# EAGLE board schematic (EAGLE 9.5.0)
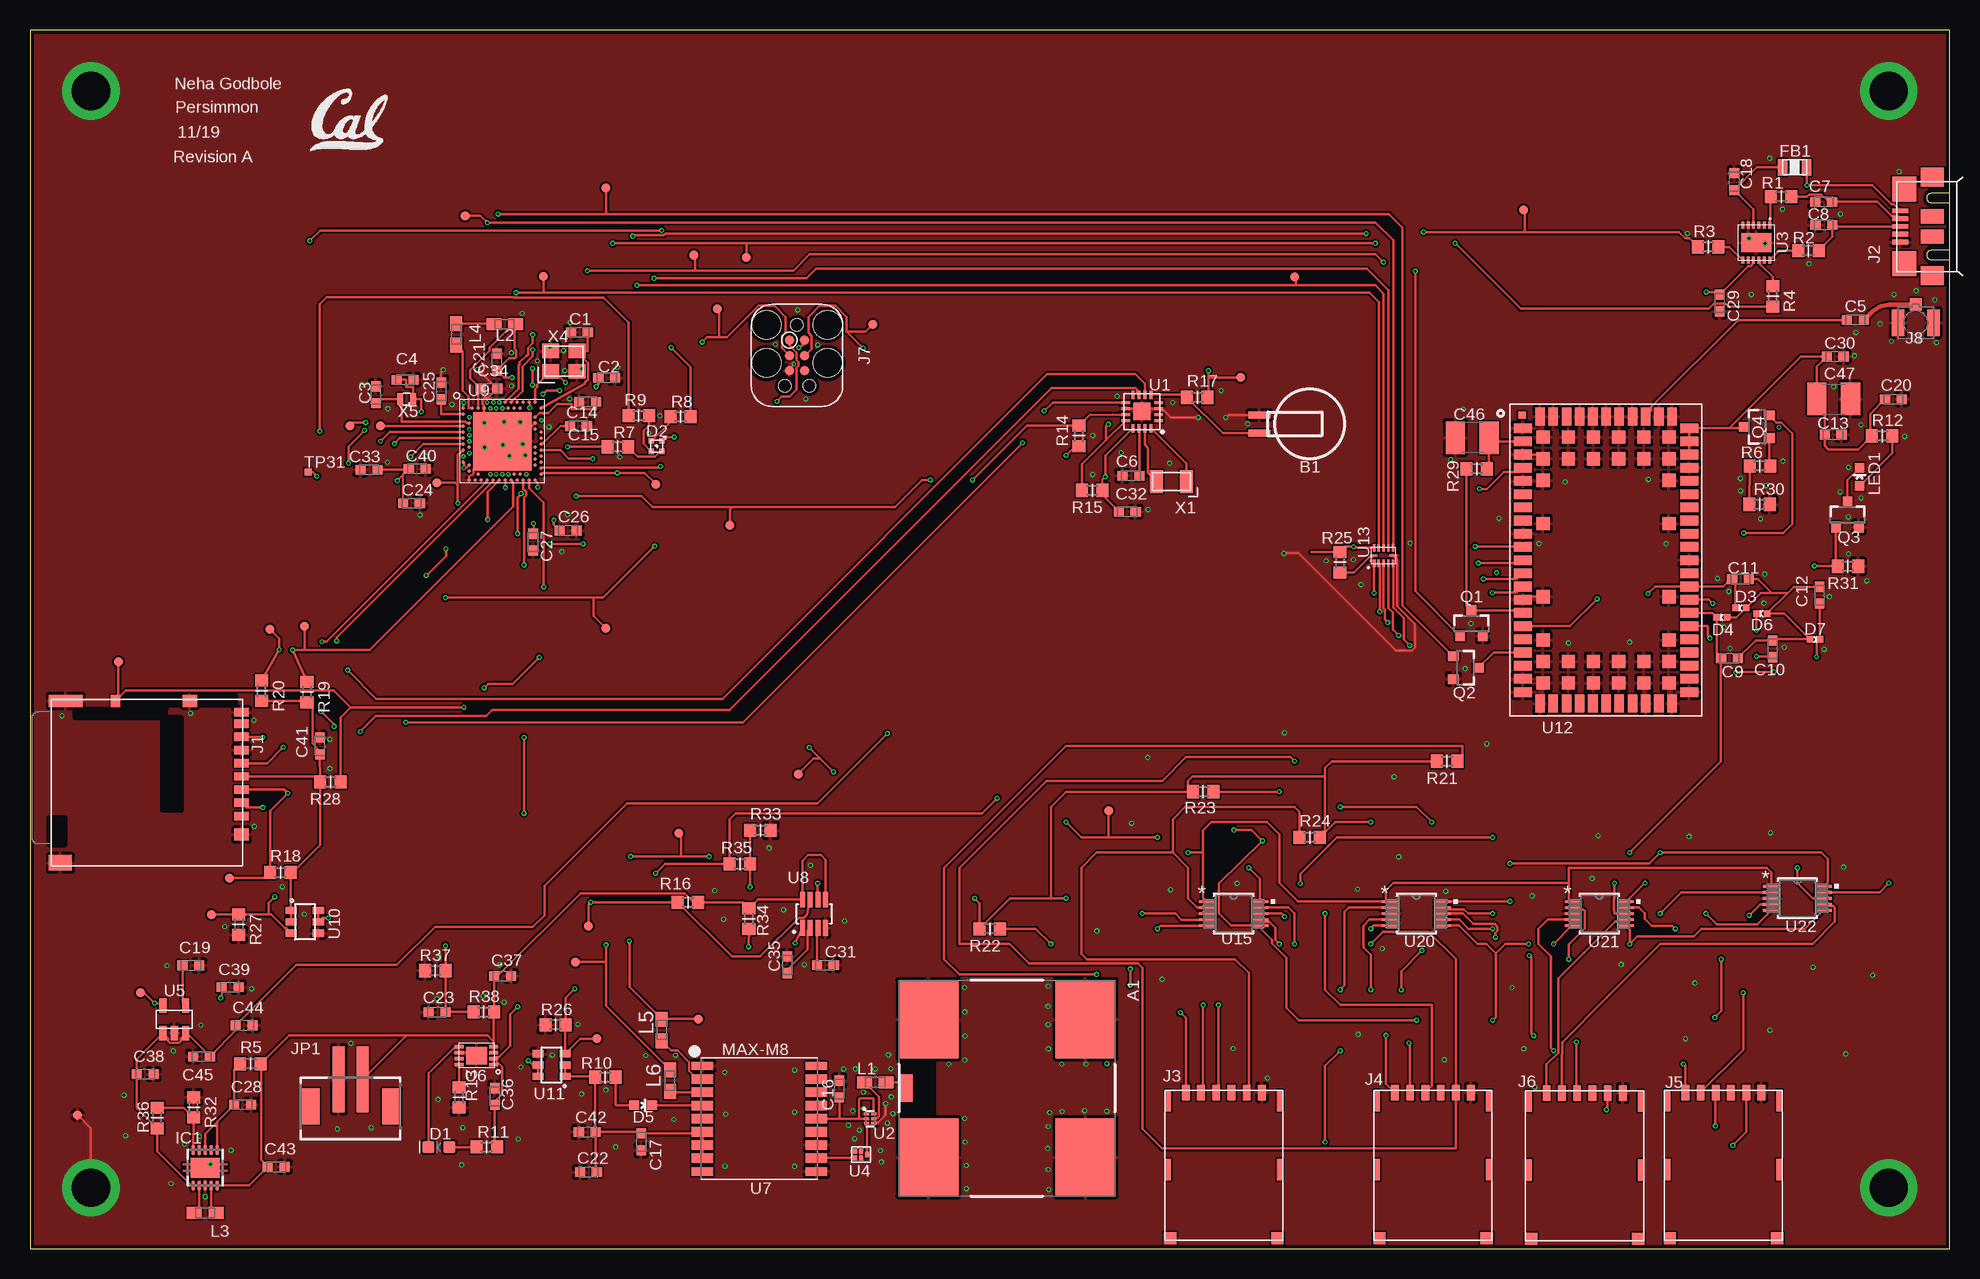
[diagram p8: board, top side]
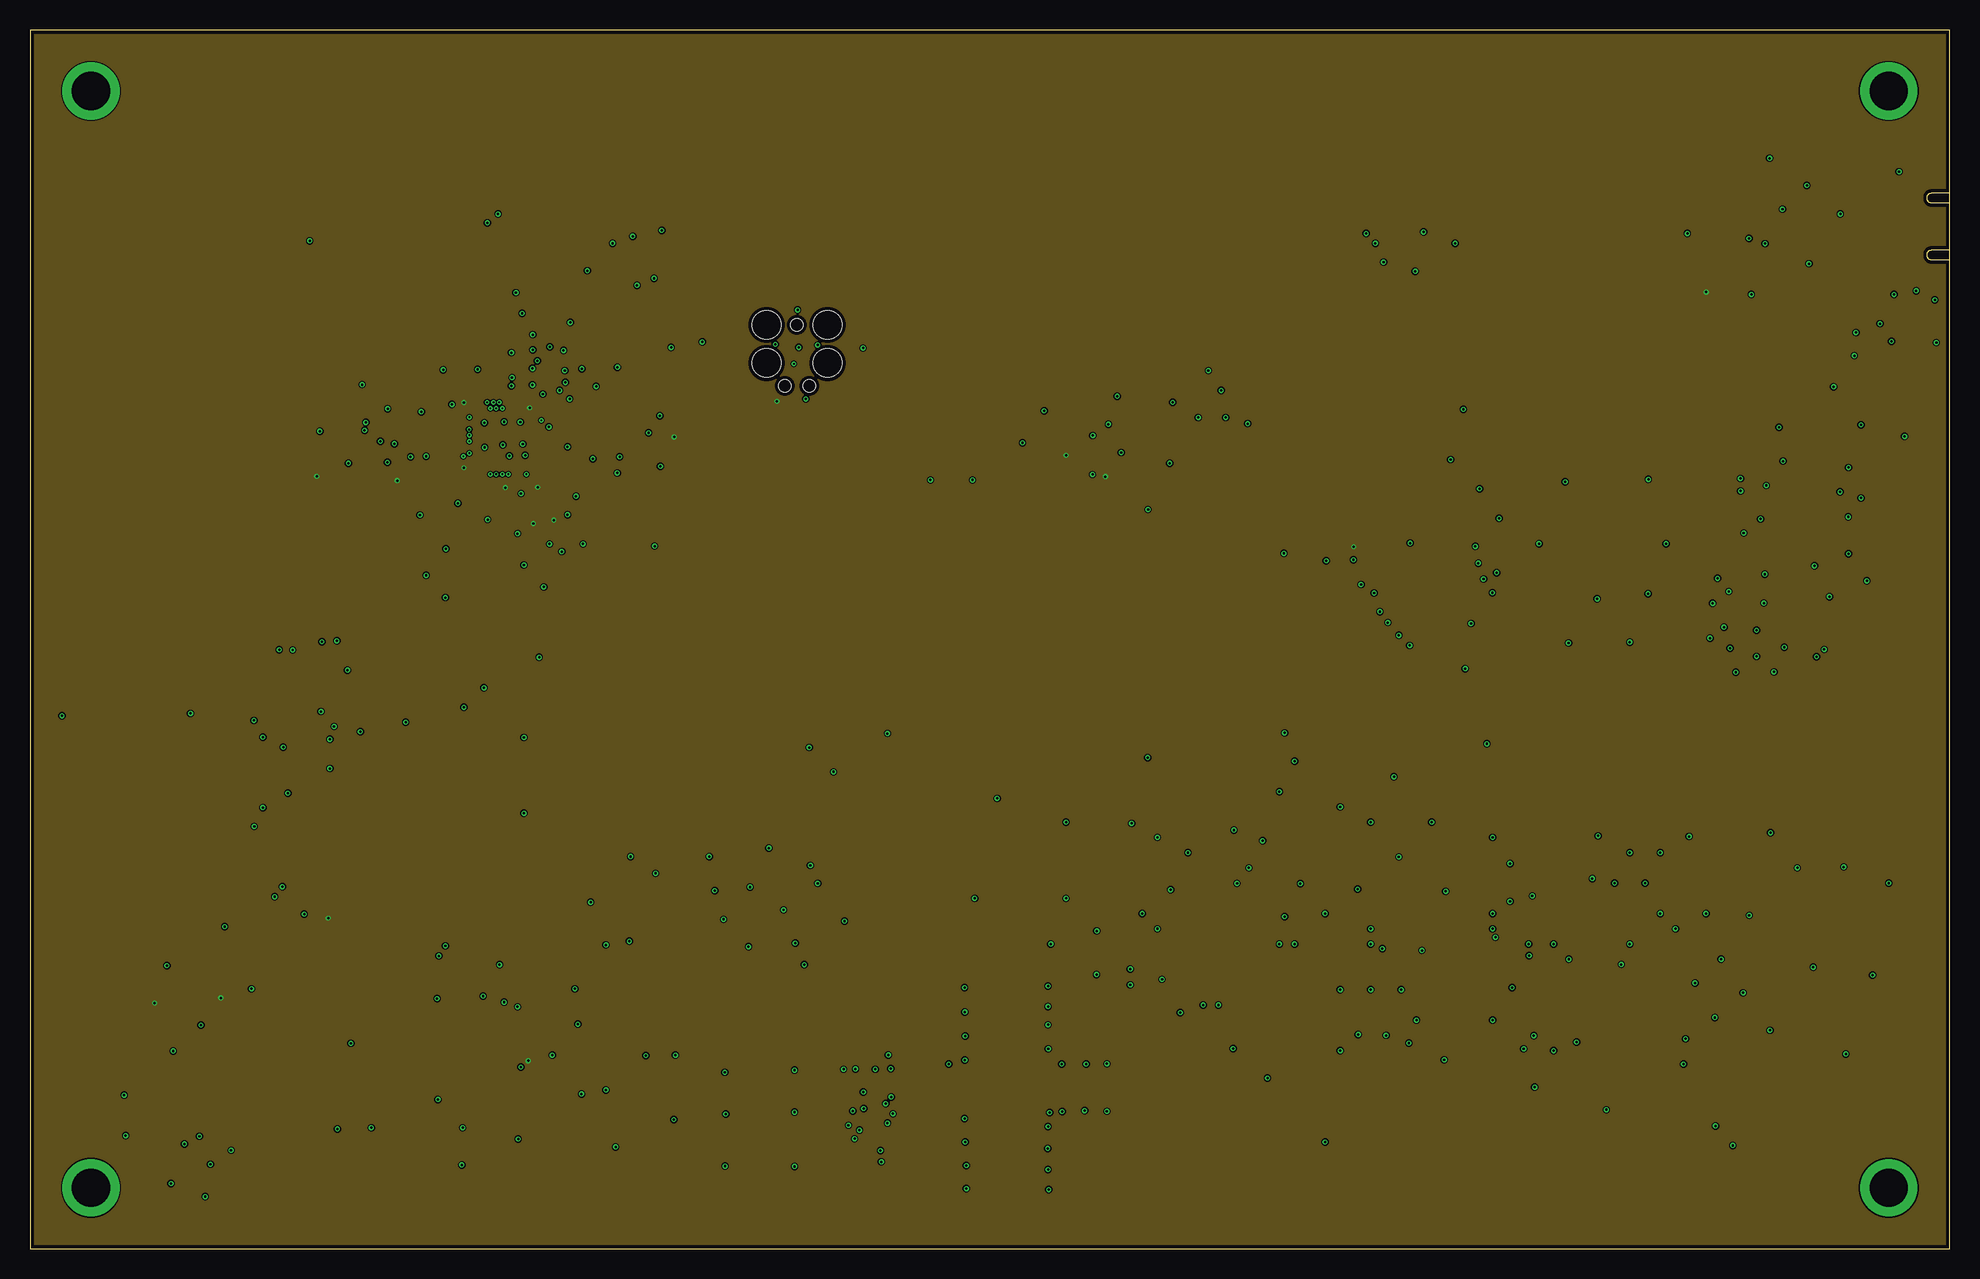
[diagram p9: board, inner layer Route15]
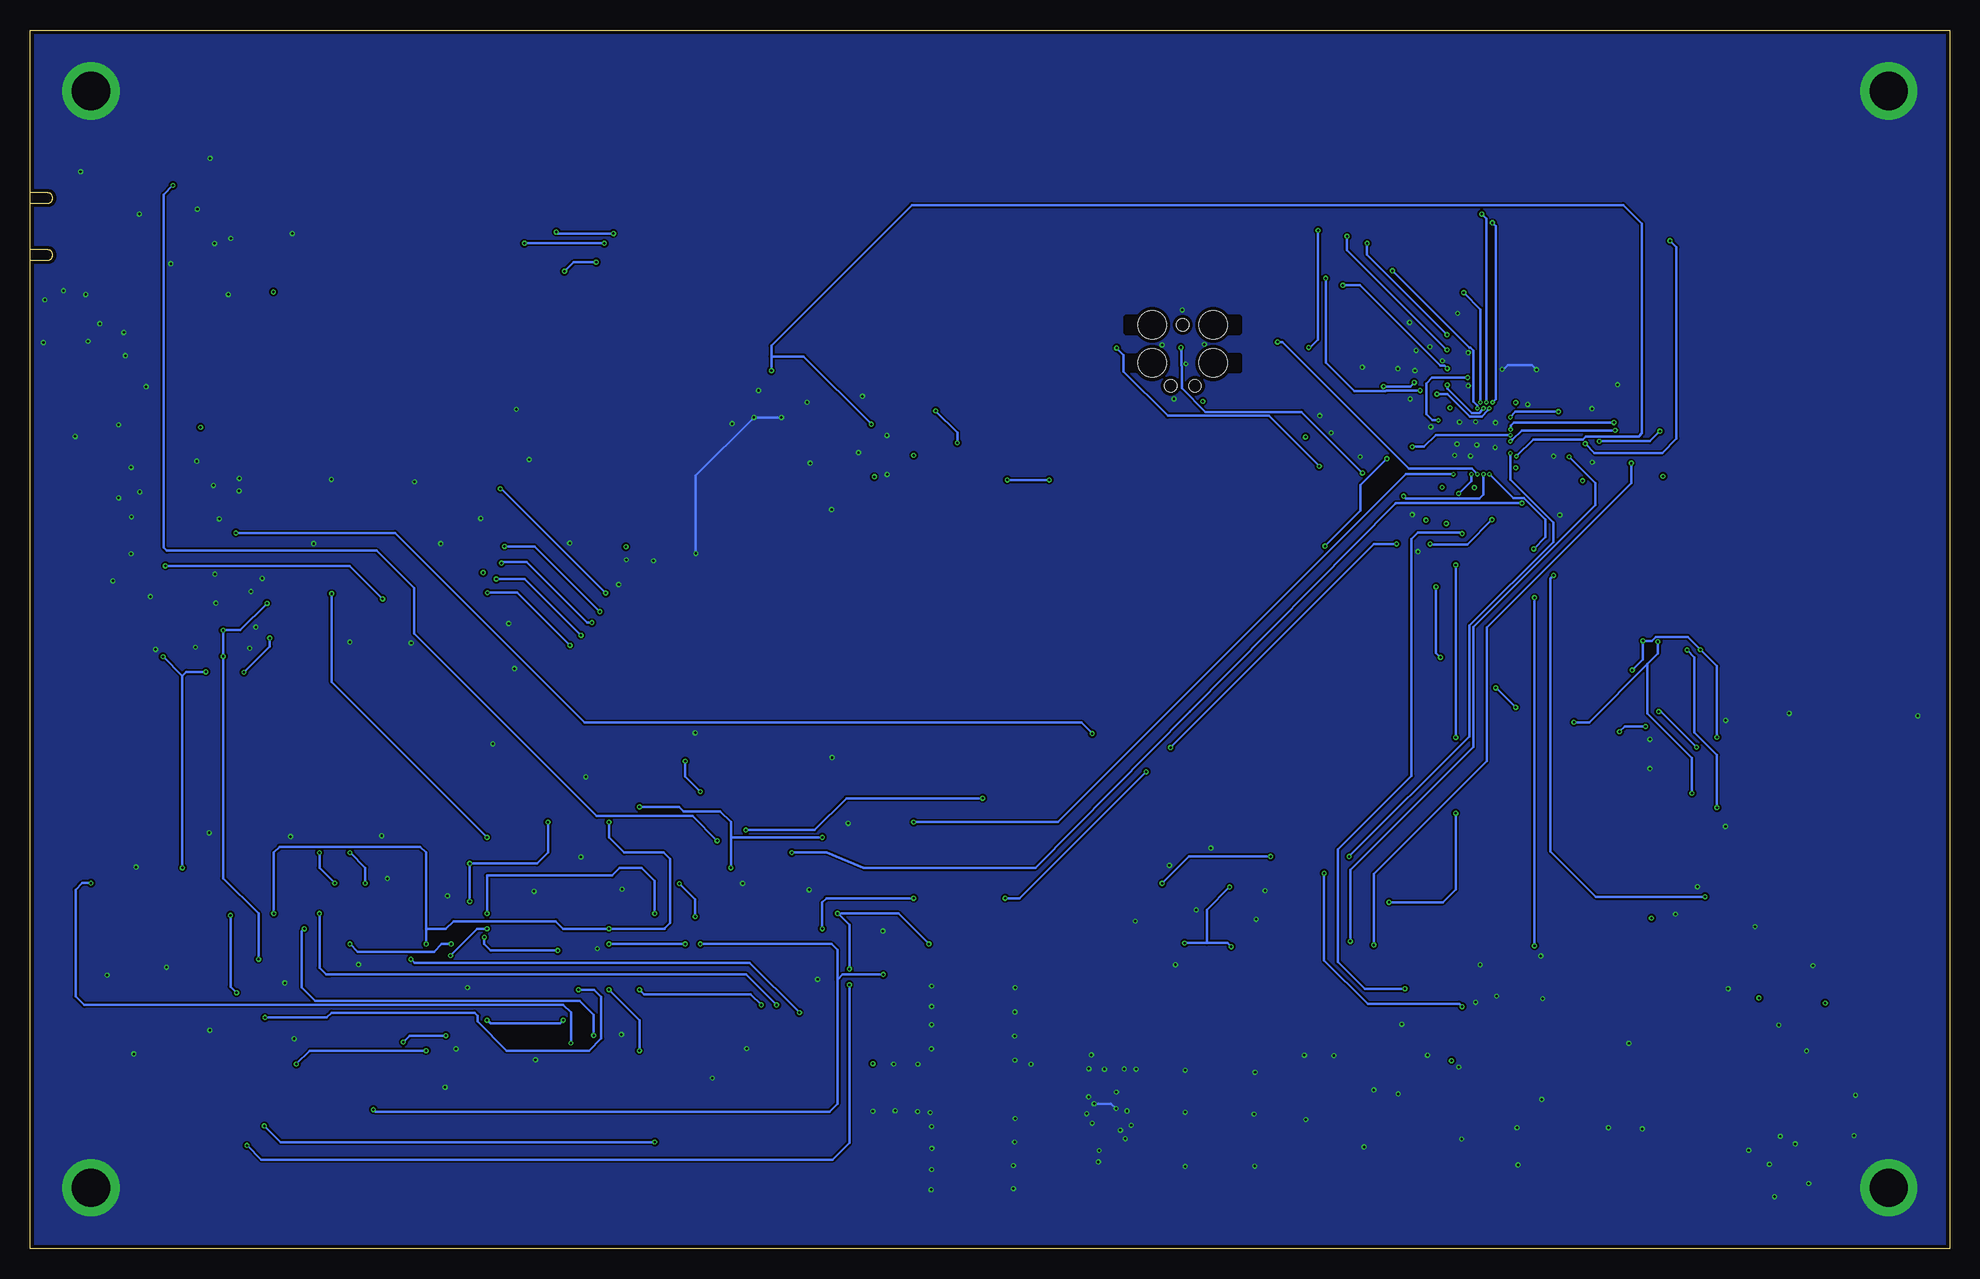
[diagram p10: board, bottom side, seen from below]

Size 160.02 x 101.6 mm. Coordinates in mm from the lower left corner, seen from the top.
Outline: 0,0 160.02,0 160.02,101.6 0,101.6 0,0
Copper layers (1*2+15*16): Top 0.035mm / dielectric 1.5mm / Route2 0.035mm / dielectric 0.15mm / Route15 0.035mm / dielectric 0.2mm / Bottom 0.035mm
Design rules "default *": minimum track width 4mil, minimum drill 6mil, track to track 4mil, track to pad 4mil, pad to pad 4mil, via to via 4mil, smd to smd 4mil, copper to edge 12mil, drill to drill 12mil, minimum pad ring 8mil, minimum via ring 4mil, stop-mask expansion 3mil, vias tented up to drill 50mil, thermal gap 10mil

## Footprints (pad centres in the part's own frame; a part is rotated, then mirrored left to right if it is on the bottom)
ANT1818B00BT1516S = smd 2.3 x 1.2: 0 0,-8.45 | smd 6.5 x 5: 1 -5.75,-6.55; 2 5.75,-6.55; 3 5.75,6.55; 4 -5.75,6.55
MS518SE-FL35E = smd 1.8 x 0.6: + 4.2,0.75; - 4.2,-0.75
RESC0603_L = smd 0.85 x 0.8: 1 -0.7,0; 2 0.7,0
C1210 = smd 1.6 x 2.7: 1 -1.4,0; 2 1.4,0
LED-0603 = smd 1 x 1: A -0.877,0; C 0.877,0
1MM_SQ_4PAD = smd 0.457 x 0.457: 1 0.432,0.432; 2 0.432,-0.432; 3 -0.432,-0.432; 4 -0.432,0.432
0402_DIODE = smd 0.536 x 0.546: ANODE -0.433,0; CATHODE 0.433,0
LED-0603' = smd 0.8 x 0.8: A 0,-0.75; C 0,0.75
0805_CAP = smd 0.8 x 1.4: P$1 1,0; P$2 -1,0
DRC-S-PVSON-N10 = smd 0.28 x 0.85: 1 -1,-1.475; 2 -0.5,-1.475; 3 0,-1.475; 4 0.5,-1.475; 5 1,-1.475; 6 1,1.475; 7 0.5,1.475; 8 0,1.475; 9 -0.5,1.475; 10 -1,1.475 | smd 2.4 x 1.65: TH 0,0
DM3AT-SF-PEJM5 = smd 0.7 x 1.2: 1 3.2,-0.1; 2 2.1,-0.1; 3 1,-0.1; 4 -0.1,-0.1; 5 -1.2,-0.1; 6 -2.3,-0.1; 7 -3.4,-0.1; 8 -4.5,-0.1; B -5.45,-0.1 | smd 1 x 0.8: A -6.4,-10.6 | smd 1 x 1.2: MOUNT0 4.75,-0.1; MOUNT1 -6.4,-4.4 | smd 1 x 2.8: MOUNT2 -6.4,-14.75 | smd 1.3 x 1.9: MOUNT3 7.1,-15.2
USB_MICRO_B-HIROSE-ZX62R-B-5P = smd 0.4 x 1.35: 1 1.3,4.125; 2 0.65,4.125; 3 0,4.125; 4 -0.65,4.125; 5 -1.3,4.125 | smd 2.1 x 2: P$1 3.1,3.8; P$2 -3.1,3.8 | smd 1.6 x 1.9: P$3 -4.1,1.45; P$6 4.1,1.45 | smd 1.2 x 1.9: P$4 -0.85,1.45; P$5 0.85,1.45
WURTH_NANO_SIM = smd 0.65 x 1.3: C1 1.905,6.07; C2 -0.635,6.07; C3 -1.905,6.07; C5 3.175,6.07; C6 0.635,6.07; C7 -3.175,6.07 | smd 1.03 x 1: P$8 -4.465,-6.07; P$9 4.465,-6.07 | smd 0.48 x 1.8: P$10 -4.66,-0.35; P$11 4.66,-0.35; P$12 -4.66,5.4; P$13 4.66,5.4
TC2030-IDC = smd 0.787 x 0.787: 1 -1.27,-0.635; 2 -1.27,0.635; 3 0,-0.635; 4 0,0.635; 5 1.27,-0.635; 6 1.27,0.635 | hole 2.375: -2.54,2.54; 0.635,2.54; 0.635,-2.54; -2.54,-2.54 | hole 1.016: -2.54,0; 2.54,1.016; 2.54,-1.016
U.FL_SMT = smd 1.05 x 2.2: GND1 -1.475,0; GND2 1.475,0 | smd 1 x 1.05: SIG 0,-1.525
JST-2-SMD-VERT = smd 1 x 5.5: GND 1,-2; VCC -1,-2 | smd 1.6 x 3: P$1 -3.4,0.27; P$2 3.4,0.27
RESC0603_M = smd 1.25 x 1: 1 -0.9,0; 2 0.9,0
SOT23-3 = smd 0.8 x 0.9: 1 -0.95,-1; 2 0.95,-1; 3 0,1.1
R0603 = smd 1 x 1.1: 1 -0.85,0; 2 0.85,0
PAD.03X.03 = smd 0.762 x 0.762: P$1 0,0
TP06SQ = smd 0.6 x 0.6: TP 0,0
QFN-16-3MM = smd 0.7 x 0.25: 1 -1.4,0.75; 2 -1.4,0.25; 3 -1.4,-0.25; 4 -1.4,-0.75; 9 1.35,-0.75; 10 1.35,-0.25; 11 1.35,0.25; 12 1.35,0.75 | smd 0.25 x 0.7: 5 -0.75,-1.4; 6 -0.25,-1.4; 7 0.25,-1.4; 8 0.75,-1.4; 13 0.75,1.4; 14 0.25,1.4; 15 -0.25,1.4; 16 -0.75,1.4 | smd 1.45 x 1.45: GND 0,0
LNA-TSLP-6-2-ALT = smd 0.45 x 0.25: 1 -0.3,0.4; 2 -0.3,0; 3 -0.3,-0.4; 4 0.3,-0.4; 5 0.3,0; 6 0.3,0.4
DFN-12/3MM = smd 0.6 x 0.25: 1 -1.45,1.13; 2 -1.45,0.68; 3 -1.45,0.23; 4 -1.45,-0.23; 5 -1.45,-0.68; 6 -1.45,-1.13; 7 1.45,-1.13; 8 1.45,-0.68; 9 1.45,-0.23; 10 1.45,0.23; 11 1.45,0.68; 12 1.45,1.13 | smd 1.6 x 2.5: 13 0,0
QCS5I = smd 0.35 x 0.425: 1 -0.5,0; 2 0,-0.287; 3 0.5,-0.287; 4 0.5,0.287; 5 0,0.287
SOT-23-5 = smd 0.6 x 1.2: 1 -0.95,-1.15; 2 0,-1.15; 3 0.95,-1.15; 4 0.95,1.15; 5 -0.95,1.15
DFN-8-MCP = smd 0.75 x 0.3: 1 -1.45,0.75; 2 -1.45,0.25; 3 -1.45,-0.25; 4 -1.45,-0.75; 5 1.45,-0.75; 6 1.45,-0.25; 7 1.45,0.25; 8 1.45,0.75 | smd 1.75 x 1.45: GND 0,0
MAX-M8 = smd 1.8 x 0.7: 1 4.75,-4.4; 9 4.75,4.4; 10 -4.75,4.4; 18 -4.75,-4.4 | smd 1.8 x 0.8: 2 4.75,-3.3; 3 4.75,-2.2; 4 4.75,-1.1; 5 4.75,0; 6 4.75,1.1; 7 4.75,2.2; 8 4.75,3.3; 11 -4.75,3.3; 12 -4.75,2.2; 13 -4.75,1.1; 14 -4.75,0; 15 -4.75,-1.1; 16 -4.75,-2.2; 17 -4.75,-3.3
SOT-23-8 = smd 0.42 x 1.3: 1 -0.975,-1.17; 2 -0.325,-1.17; 3 0.325,-1.17; 4 0.975,-1.17; 5 0.975,1.17; 6 0.325,1.17; 7 -0.325,1.17; 8 -0.975,1.17
AQFN73 = smd 0.3 x 0.3: A8 -1.25,3.25; A10 -0.75,3.25; A12 -0.25,3.25; A14 0.25,3.25; A16 0.75,3.25; A18 1.25,3.25; A20 1.75,3.25; A22 2.25,3.25; A23 2.75,3.25; AA24 3.25,-2.25; AB2 -2.75,-2.5; AC5 -2,-2.75; AC9 -1,-2.75; AC11 -0.5,-2.75; AC13 0,-2.75; AC15 0.5,-2.75; AC17 1,-2.75; AC19 1.5,-2.75; AC21 2,-2.75; AC24 3.25,-2.75; AD2 -2.75,-3.25; AD4 -2.25,-3.25; AD6 -1.75,-3.25; AD8 -1.25,-3.25; AD10 -0.75,-3.25; AD12 -0.25,-3.25; AD14 0.25,-3.25; AD16 0.75,-3.25; AD18 1.25,-3.25; AD20 1.75,-3.25; AD22 2.25,-3.25; AD23 2.75,-3.25; B1 -3.25,2.75; B3 -2.5,2.75; B5 -2,2.75; B7 -1.5,2.75; B9 -1,2.75; B11 -0.5,2.75; B13 0,2.75; B15 0.5,2.75; B17 1,2.75; B19 1.5,2.75; B24 3.25,2.75; C1 -3.25,2.25; D2 -2.75,2; D23 2.75,2; E24 3.25,1.75; F2 -2.75,1.5; F23 2.75,1.5; G1 -3.25,1.25; H2 -2.75,1; H23 2.75,1; J1 -3.25,0.75; J24 3.25,0.75; K2 -2.75,0.5; L1 -3.25,0.25; L24 3.25,0.25; M2 -2.75,0; N1 -3.25,-0.25; N24 3.25,-0.25; P2 -2.75,-0.5; P23 2.75,-0.5; R1 -3.25,-0.75; R24 3.25,-0.75; T2 -2.75,-1; T23 2.75,-1; U1 -3.25,-1.25; U24 3.25,-1.25; V23 2.75,-1.5; W1 -3.25,-1.75; W24 3.25,-1.75; Y2 -2.75,-2; Y23 2.75,-2 | smd 4.85 x 4.85: GND 0,0
TSOT23-6 = smd 0.6 x 0.927: 1 -0.95,-1.126; 2 0,-1.126; 3 0.95,-1.126; 4 0.95,1.126; 5 0,1.126; 6 -0.95,1.126
UBLOX_SARA_G3 = smd 0.8 x 1.5: 1 -11,-6.95; 2 -9.9,-6.95; 3 -8.8,-6.95; 4 -7.7,-6.95; 5 -6.6,-6.95; 6 -5.5,-6.95; 7 -4.4,-6.95; 8 -3.3,-6.95; 9 -2.2,-6.95; 10 -1.1,-6.95; 11 0,-6.95; 12 1.1,-6.95; 13 2.2,-6.95; 14 3.3,-6.95; 15 4.4,-6.95; 16 5.5,-6.95; 17 6.6,-6.95; 18 7.7,-6.95; 19 8.8,-6.95; 20 9.9,-6.95; 21 11,-6.95; 33 11,6.95; 34 9.9,6.95; 35 8.8,6.95; 36 7.7,6.95; 37 6.6,6.95; 38 5.5,6.95; 39 4.4,6.95; 40 3.3,6.95; 41 2.2,6.95; 42 1.1,6.95; 43 0,6.95; 44 -1.1,6.95; 45 -2.2,6.95; 46 -3.3,6.95; 47 -4.4,6.95; 48 -5.5,6.95; 49 -6.6,6.95; 50 -7.7,6.95; 51 -8.8,6.95; 52 -9.9,6.95; 53 -11,6.95 | smd 0.6 x 0.6: 1IND -12.1,-7 | smd 1.5 x 0.8: 22 11.95,-5.5; 23 11.95,-4.4; 24 11.95,-3.3; 25 11.95,-2.2; 26 11.95,-1.1; 27 11.95,0; 28 11.95,1.1; 29 11.95,2.2; 30 11.95,3.3; 31 11.95,4.4; 32 11.95,5.5; 54 -11.95,5.5; 55 -11.95,4.4; 56 -11.95,3.3; 57 -11.95,2.2; 58 -11.95,1.1; 59 -11.95,0; 60 -11.95,-1.1; 61 -11.95,-2.2; 62 -11.95,-3.3; 63 -11.95,-4.4; 64 -11.95,-5.5 | smd 1.1 x 1.1: 65 -10.25,-5.25; 66 -10.25,-3.15; 67 -10.25,-1.05; 68 -10.25,1.05; 69 -10.25,3.15; 70 -10.25,5.25; 71 -8.45,-5.25; 72 -8.45,-3.15; 73 -8.45,-1.05; 74 -8.45,1.05; 75 -8.45,3.15; 76 -8.45,5.25; 77 -6.65,-5.25; 78 -6.65,5.25; 79 -3.05,-5.25; 80 -3.05,5.25; 81 3.05,-5.25; 82 3.05,5.25; 83 6.65,-5.25; 84 6.65,5.25; 85 8.45,-5.25; 86 8.45,-3.15; 87 8.45,-1.05; 88 8.45,1.05; 89 8.45,3.15; 90 8.45,5.25; 91 10.25,-5.25; 92 10.25,-3.15; 93 10.25,-1.05; 94 10.25,1.05; 95 10.25,3.15; 96 10.25,5.25
UQFN-12 = smd 0.2 x 0.6: 1 -0.8,-0.65; 2 -0.4,-0.65; 3 0,-0.65; 4 0.4,-0.65; 5 0.8,-0.65; 7 0.8,0.65; 8 0.4,0.65; 9 0,0.65; 10 -0.4,0.65; 11 -0.8,0.65 | smd 0.6 x 0.2: 6 0.8,0; 12 -0.8,0
21-0061L = smd 1.422 x 0.229: 1 -2.172,1; 2 -2.172,0.5; 3 -2.172,0; 4 -2.172,-0.5; 5 -2.172,-1; 6 2.172,-1; 7 2.172,-0.5; 8 2.172,0; 9 2.172,0.5; 10 2.172,1
2-SMD = smd 1.092 x 1.905: 1 -1.245,0; 2 1.245,0
TXC-7V = smd 1.4 x 1.2: 1 -1.1,-0.85; 2 1.1,-0.85; 3 1.1,0.85; 4 -1.1,0.85
ABS05 = smd 0.5 x 1: A -0.55,0; B 0.55,0

## Placement (x,y rotation side)
A1  GPS-ANTENNA  [ANT1818B00BT1516S]  81.43,13.39 270 top
B1  [MS518SE-FL35E]  106.68,68.76 180 top
C1  12pF  [RESC0603_L]  45.8,76.4 0 top
C2  12pF  [RESC0603_L]  48.08,72.59 180 top
C3  12pF  [RESC0603_L]  28.83,71.2 270 top
C4  12pF  [RESC0603_L]  31.27,72.44 180 top
C5  33pF  [RESC0603_L]  152.15,77.42 0 top
C6  47pF  [RESC0603_L]  91.77,64.44 180 top
C7  47pF  [RESC0603_L]  149.5,87.27 180 top
C8  47pF  [RESC0603_L]  149.53,85.34 180 top
C9  47pF  [RESC0603_L]  141.66,49.23 0 top
C10  47pF  [RESC0603_L]  145.24,50.01 90 top
C11  47pF  [RESC0603_L]  142.57,55.83 0 top
C12  47pF  [RESC0603_L]  149.17,54.48 90 top
C13  56pF  [RESC0603_L]  150.29,67.87 0 top
C14  100pF  [RESC0603_L]  46.48,70.59 180 top
C15  820pF  [RESC0603_L]  45.72,68.58 0 top
C16  10nF  [RESC0603_L]  67.46,13.31 270 top
C17  10nF  [RESC0603_L]  50.95,8.92 90 top
C18  10nF  [RESC0603_L]  142.06,88.95 90 top
C19  10nF  [RESC0603_L]  13.41,23.62 0 top
C20  10nF  [RESC0603_L]  155.32,70.82 0 top
C21  47nF  [RESC0603_L]  38.91,73.91 90 top
C22  0.1uF  [RESC0603_L]  46.56,6.38 0 top
C23  0.1uF  [RESC0603_L]  33.93,19.71 0 top
C24  0.1uF  [RESC0603_L]  31.8,62.15 0 top
C25  0.1uF  [RESC0603_L]  34.29,71.5 90 top
C26  0.1uF  [RESC0603_L]  44.86,59.87 0 top
C27  0.1uF  [RESC0603_L]  41.94,58.9 270 top
C28  .1uF  [RESC0603_L]  17.73,12.01 0 top
C29  .1uF  [RESC0603_L]  140.84,78.84 270 top
C30  .1uF  [RESC0603_L]  150.47,74.37 0 top
C31  0.82uF  [RESC0603_L]  66.29,23.65 0 top
C32  1uF  [RESC0603_L]  91.47,61.44 0 top
C33  1uF  [RESC0603_L]  28.27,64.95 180 top
C34  1uF  [RESC0603_L]  38.25,71.7 0 top
C35  2.2uF  [RESC0603_L]  63.12,23.67 90 top
C36  4.7uF  [RESC0603_L]  38.73,12.7 90 top
C37  4.7uF  [RESC0603_L]  39.4,22.73 0 top
C38  4.7uF  [RESC0603_L]  9.6,14.55 0 top
C39  4.7uF  [RESC0603_L]  16.69,21.79 0 top
C40  4.7uF  [RESC0603_L]  32.28,65.02 0 top
C41  4.7uF  [RESC0603_L]  24.16,41.91 90 top
C42  10uF  [RESC0603_L]  46.46,9.73 0 top
C43  10uF  [RESC0603_L]  20.52,6.83 0 top
C44  10uF  [RESC0603_L]  17.86,18.62 0 top
C45  10uF  [RESC0603_L]  14.3,16.03 180 top
C46  100uF  [C1210]  120.22,67.61 180 top
C47  220uF  [C1210]  150.34,70.84 0 top
D1  GREEN  [LED-0603]  34.09,8.46 180 top
D2  SML-LX0404SIUPGUSB  [1MM_SQ_4PAD]  52.22,66.9 0 top
D3  14V  [0402_DIODE]  142.6,53.42 180 top
D4  14V  [0402_DIODE]  141.02,52.63 180 top
D5  BLUE  [LED-0603']  51.1,11.96 270 top
D6  14V  [0402_DIODE]  144.35,52.93 180 top
D7  14V  [0402_DIODE]  148.79,50.8 0 top
FB1  600Ω  [0805_CAP]  147.09,90.14 180 top
IC1  TPS6300  [DRC-S-PVSON-N10]  14.61,6.76 0 top
J1  CON_MICRO_SDDM3AT-SF-PEJM5  [DM3AT-SF-PEJM5]  17.73,39.27 270 top
J2  MICRO_USB_B_HIROSE_ZX62R-B-5P  [USB_MICRO_B-HIROSE-ZX62R-B-5P]  160.02,85.22 90 top
J3  NANO_SIM  [WURTH_NANO_SIM]  99.52,6.96 0 top
J4  NANO_SIM  [WURTH_NANO_SIM]  116.94,6.96 0 top
J5  NANO_SIM  [WURTH_NANO_SIM]  141.15,6.96 0 top
J6  NANO_SIM  [WURTH_NANO_SIM]  129.59,6.91 0 top
J7  TC2030-JLINK-L  [TC2030-IDC]  63.93,74.47 270 top
J8  U.FL-R-SMT  [U.FL_SMT]  157.18,77.19 180 top
JP1  [JST-2-SMD-VERT]  26.75,12.14 180 top
L1  5.6nH  [RESC0603_M]  70.46,13.87 0 top
L2  15nH  [RESC0603_M]  39.57,77.06 180 top
L3  2.2uH  [RESC0603_M]  14.61,3 180 top
L4  10uH  [RESC0603_M]  35.53,76.23 270 top
L5  1k  [RESC0603_M]  52.65,18.24 90 top
L6  1k  [RESC0603_M]  53.34,14.02 90 top
LED1  BLUE  [LED-0603']  152.5,64.34 0 top
Q1  MOSFET-NCHANNELSMD  [SOT23-3]  120.14,52.1 0 top
Q2  MOSFET-NCHANNELSMD  [SOT23-3]  119.63,48.44 270 top
Q3  MOSFET-NCHANNELSMD  [SOT23-3]  151.49,61.16 0 top
Q4  SI223DDS  [SOT23-3]  143.97,68.53 90 top
R1  27  [R0603]  145.97,87.71 180 top
R2  27  [R0603]  148.23,83.21 180 top
R3  100  [R0603]  139.88,83.52 180 top
R4  100  [R0603]  145.26,79.4 270 top
R5  100  [R0603]  18.39,15.42 0 top
R6  100  [R0603]  144.2,65.25 180 top
R7  470  [R0603]  49,66.85 180 top
R8  470  [R0603]  54.23,69.37 0 top
R9  470  [R0603]  50.75,69.44 180 top
R10  1k  [R0603]  47.96,14.3 180 top
R11  1k  [R0603]  38.07,8.48 0 top
R12  1k  [R0603]  154.38,67.77 180 top
R13  2k  [R0603]  35.76,12.62 90 top
R14  10k  [R0603]  87.43,67.77 90 top
R15  10k  [R0603]  88.54,63.22 180 top
R16  10k  [R0603]  54.84,28.88 180 top
R17  10k  [R0603]  97.31,70.97 0 top
R18  10k  [R0603]  20.88,31.37 0 top
R19  10k  [R0603]  23.09,46.41 270 top
R20  10k  [R0603]  19.3,46.51 270 top
R21  10k  [R0603]  118.11,40.64 180 top
R22  10k  [R0603]  80.01,26.67 180 top
R23  10k  [R0603]  97.79,38.1 180 top
R24  10k  [R0603]  106.68,34.29 0 top
R25  10k  [R0603]  109.19,57.23 90 top
R26  100k  [R0603]  43.81,18.67 0 top
R27  100k  [R0603]  17.4,27.03 270 top
R28  100k  [R0603]  25.04,38.91 180 top
R29  100k  [R0603]  120.6,65.02 0 top
R30  100k  [R0603]  144.17,62.05 180 top
R31  100k  [R0603]  151.54,56.9 180 top
R32  200k  [R0603]  13.64,11.79 270 top
R33  499k  [R0603]  60.88,34.87 0 top
R34  825k  [R0603]  59.92,27.51 270 top
R35  1M  [R0603]  59.18,32.08 0 top
R36  1.3M  [R0603]  10.59,10.9 270 top
R37  2.2M  [R0603]  33.78,23.19 0 top
R38  10M  [R0603]  37.82,19.74 0 top
TP1  TEST-POINT  [PAD.03X.03]  45.44,23.9 0 top
TP2  TEST-POINT  [PAD.03X.03]  55.73,19.15 0 top
TP3  TEST-POINT  [PAD.03X.03]  54.08,34.65 0 top
TP4  TEST-POINT  [PAD.03X.03]  100.91,72.64 0 top
TP5  TEST-POINT  [PAD.03X.03]  16.61,30.91 0 top
TP6  TEST-POINT  [PAD.03X.03]  15.11,27.84 0 top
TP7  TEST-POINT  [PAD.03X.03]  20.02,51.64 0 top
TP8  TEST-POINT  [PAD.03X.03]  58.34,60.3 0 top
TP9  TEST-POINT  [PAD.03X.03]  64.03,39.57 0 top
TP10  TEST-POINT  [PAD.03X.03]  47.24,17.5 0 top
TP11  TEST-POINT  [PAD.03X.03]  22.89,51.89 0 top
TP12  TEST-POINT  [PAD.03X.03]  46.56,26.9 0 top
TP13  TEST-POINT  [PAD.03X.03]  57.3,78.36 0 top
TP14  TEST-POINT  [PAD.03X.03]  52.17,63.73 0 top
TP15  TEST-POINT  [PAD.03X.03]  70.23,77.04 0 top
TP16  TEST-POINT  [PAD.03X.03]  42.8,81.05 0 top
TP17  TEST-POINT  [PAD.03X.03]  55.35,82.83 0 top
TP18  TEST-POINT  [PAD.03X.03]  105.41,81 0 top
TP19  TEST-POINT  [PAD.03X.03]  48.01,88.42 0 top
TP20  TEST-POINT  [PAD.03X.03]  36.27,86.11 0 top
TP21  TEST-POINT  [PAD.03X.03]  7.37,48.92 0 top
TP22  TEST-POINT  [PAD.03X.03]  48.01,51.71 0 top
TP23  TEST-POINT  [PAD.03X.03]  33.93,63.86 0 top
TP24  TEST-POINT  [PAD.03X.03]  124.49,86.61 0 top
TP25  TEST-POINT  [PAD.03X.03]  59.72,82.63 0 top
TP26  TEST-POINT  [PAD.03X.03]  89.92,36.53 0 top
TP27  TEST-POINT  [PAD.03X.03]  9.22,21.36 0 top
TP28  TEST-POINT  [PAD.03X.03]  3.96,11.15 0 top
TP29  TEST-POINT  [PAD.03X.03]  26.67,68.58 0 top
TP30  TEST-POINT  [PAD.03X.03]  29.21,68.58 0 top
TP31  TPTP06SQ  [TP06SQ]  23.19,64.74 0 top
U1  AB1815-T3  [QFN-16-3MM]  92.68,69.8 180 top
U2  BGA725L6-ALT  [LNA-TSLP-6-2-ALT]  70.03,10.85 0 top
U3  FTDI234XD  [DFN-12/3MM]  143.89,83.87 270 top
U4  SAFFB1G56KB0F0A  [QCS5I]  69.27,7.85 180 top
U5  MAX8887EZK33+T  [SOT-23-5]  12.04,19.13 0 top
U6  MCP73831  [DFN-8-MCP]  37.21,16.1 180 top
U7  MAX-M8  [MAX-M8]  60.81,10.85 180 top
U8  MAX67XXMAX6749MAX67XX  [SOT-23-8]  65.35,27.91 0 top
U9  NRF52840  [AQFN73]  39.37,67.31 0 top
U10  SIP32510  [TSOT23-6]  22.91,27.25 270 top
U11  SIP32510  [TSOT23-6]  43.48,15.32 90 top
U12  UBLOX_SARA_G350  [UBLOX_SARA_G3]  131.37,57.4 270 top
U13  TXB0104RUT  [UQFN-12]  112.83,57.78 0 top
U15  MAX4734EUB+  [21-0061L]  100.33,27.94 0 top
U20  MAX4734EUB+  [21-0061L]  115.57,27.94 0 top
U21  MAX4734EUB+  [21-0061L]  130.81,27.94 0 top
U22  MAX4734EUB+  [21-0061L]  147.32,29.21 0 top
U$3  [UCB_CAL_200MIL]  23.34,91.54 0 top
X1  ABS07-32.768KHZ-7-T  [2-SMD]  95.15,63.96 180 top
X4  32MHz  [TXC-7V]  44.5,73.99 0 top
X5  32.768kHz  [ABS05]  31.39,70.84 180 top

## Tracks (layer width: path | path; a pad name or v marks a point on that pad's centre or on a via)
5V  (via drill 0.2)
  Top 0.203: U21.6 133.35,26.57 v133.35,25.4 133.99,26.04 138.69,26.04 139.32,26.67 147.95,26.67 U22.6 | U20.6 119.11,26.94 120.65,25.4 121.39,25.4 122.17,24.61 | U15.6 102.31,26.94 | 102.31,26.94 100.12,26.94 99.12,27.94 99.12,30.47 102.73,34 | 122.17,24.61 122.17,19.3 v121.92,19.05 | FB1.P$2 148.18,90.1 148.11,90.03 v148.11,88.65 153.55,88.65 155.14,87.06 155.35,87.06 J2.1 | 102.73,34 v102.74,34.01 | v124.92,25.4 122.96,25.4 122.17,24.61 | 102.31,26.94 103.51,25.74 103.51,25.46 104.72,24.24 104.72,20.09 105.79,19.02 115.55,19.02 v115.57,19.05 | U6.2 U6.1 | U6.2 39.34,15.18 39.34,12.89 38.73,12.29 C36.1 38.73,8.67 R11.2 | v52.15,31.29 52.93,32.08 R35.1 58.33,35.78 58.83,36.27 79.35,36.27 v80.62,37.54 | U6.2 38.81,16 39.12,16 40.03,16.91 40.03,19.56 v40.64,20.17 | v100.36,34.9 101.83,34.9 102.73,34
  Bottom 0.203: v121.92,19.05 121.64,18.77 115.85,18.77 v115.57,19.05 | v133.35,25.4 132.71,24.76 126.34,24.76 125.7,25.4 v124.92,25.4 | v52.15,31.29 52.15,24.05 48.51,20.42 40.89,20.42 v40.64,20.17 | v80.62,37.54 91.97,37.54 94.61,34.9 v100.36,34.9 | v102.74,34.01 104.8,36.07 112.78,36.07 128.02,51.31 128.02,55.07 131.14,58.19 148.62,58.19 148.87,58.45 148.87,87.88 v148.11,88.65
!CHRG
  Top 0.203: D1.A 37.2,8.46 R11.1
!EXTERNAL_RST  (via drill 0.2)
  Top 0.203: U8.7 64.77,27.86 64.5,27.6 64.08,27.6 60.85,24.36 58.51,24.36 R16.2 46.76,28.88 | U9.AD20 41.12,63.34 41.34,63.12 41.34,62.79 41.17,62.62 v41.17,57 | 46.76,28.88 v46.74,28.88 | v41.17,36.3 v41.17,42.62 | TP12.P$1 46.56,28.68 46.76,28.88
  Bottom 0.203: v46.74,28.88 42.24,28.88 41.17,29.95 v41.17,36.3 | v41.17,42.62 v41.17,57
!NRF_CS_SD  (via drill 0.2)
  Top 0.203: U9.AD16 40.22,63.96 40.22,63.89 40.28,63.82 40.28,61.87 28.32,49.91 22.91,49.91 | R19.1 v21.89,49.91 22.91,49.91 | v19.41,36.78 18.02,36.78 J1.2 | TP11.P$1 22.91,51.87 22.91,49.91
  Bottom 0.203: v19.41,36.78 19.41,41.15 21.29,43.03 21.29,49.3 v21.89,49.91
!NRF_RST  (via drill 0.15 pad 0.1, 0.2)
  Top 0.203: U9.AC13 v39.37,64.57 | J7.3 62.7,75.07 62.7,76.07 62.99,76.35 62.99,77.67 62.05,78.61 60.73,78.61 58.12,76 57.43,76 | v56.03,75.59 56.44,76 57.43,76 | TP13.P$1 57.43,78.23 57.43,76
  Bottom 0.203: v56.03,75.59 55.64,75.59 45.1,65.05 39.82,65.05 39.37,64.6 v39.37,64.57
!RTC_CS  (via drill 0.15, 0.2)
  Top 0.203: v98.22,73.2 98.22,72.62 | 98.22,72.62 98.22,71.03 R17.2 | U9.U1 | R15.2 87.69,65.41 89.7,67.42 | 89.7,67.42 U1.12 | 89.7,67.42 89.7,68.55 v89.89,68.73 | 98.22,72.62 100.89,72.62 TP4.P$1
  Bottom 0.203: 98.22,74.37 98.22,75.29 86.5,87.01 27.22,87.01 25.65,85.45 25.65,68 25.93,67.72 30.34,67.72 30.6,67.46 34.72,67.46 U9.U1 | 98.22,74.37 v98.22,73.2 | v89.89,68.73 95.53,74.37 98.22,74.37
  other vias: 36.12,66.07
!RTC_INT1  (via drill 0.15, 0.2)
  Top 0.152: U1.11 90.26,69.55 90.25,69.55 88.36,69.55 R14.2
  Top 0.203: R14.2 83.09,68.62 v78.56,64.08 | U9.AC11 v38.86,64.57 | v45.52,62.74 50.99,62.74 51.9,61.82 58.55,61.82 | 58.55,61.82 72.08,61.82 74.35,64.08 v75.06,64.08 | TP8.P$1 58.34,61.62 58.55,61.82
  Bottom 0.203: v78.56,64.08 v75.06,64.08 | v38.86,64.57 38.86,62.89 39.22,62.53 45.31,62.53 v45.52,62.74
!SD_DETECT  (via drill 0.2)
  Top 0.203: U9.AD22 41.62,63.41 42.82,62.2 v42.82,55.17 | v42.44,49.3 40.23,47.09 38.18,47.09 v37.85,46.76 | 26.73,45.14 v36.17,45.14 | R28.1 25.89,44.3 26.73,45.14 | 26.73,45.14 25.33,46.53 7.99,46.53 J1.A 7.37,45.91 TP21.P$1
  Bottom 0.203: v42.82,55.17 42.82,49.68 v42.44,49.3 | v36.17,45.14 37.8,46.76 v37.85,46.76
ANT
  Top 0.203: A1.0 72.5,13.87 L1.2
BAT
  Top 0.203: 38.66,17.25 U6.4 U6.3 | 38.66,17.25 38.66,19.73 R38.2 38.67,22.71 C37.1 38.98,22.73 45.88,29.63 54.57,29.63 55.33,28.88 R16.1 59.4,28.88 R34.1 60.67,29.11 64.38,29.11 U8.8 64.38,32.32 64.87,32.82 65.94,32.82 66.33,32.43 U8.5 | JP1.VCC 31.39,17.78 | 31.39,17.78 38.13,17.78 38.66,17.25 | R5.2 19.26,15.44 | 19.26,15.44 21.6,17.78 31.39,17.78 | 19.26,15.44 19.26,7.4 C43.1 18.27,5.28 IC1.5
BATIN  (via drill 0.2)
  Top 0.203: C23.2 34.63,19.81 | 34.63,19.81 R37.2 34.63,25.24 v34.62,25.25 | R38.1 34.71,19.74 34.63,19.81 | U9.R24 44.21,66.56 44.91,65.86 v46.91,65.86 | v34.62,54.28 46.99,54.28 | 46.99,54.28 47.78,54.28 v52.07,58.57 | TP22.P$1 46.99,52.73 46.99,54.28
  Bottom 0.203: v34.62,25.25 v34.62,54.28 | v46.91,65.86 49.12,63.65 49.12,61.52 v52.07,58.57
CLK1  (via drill 0.2)
  Top 0.203: J3.C3 97.79,13.21 v97.79,20.32 | v135.89,27.94 137.66,29.71 U22.2
  Bottom 0.203: v97.79,20.32 100.33,22.86 135.03,22.86 135.33,22.86 135.89,23.42 v135.89,27.94
CLK2  (via drill 0.2)
  Top 0.203: J4.C3 115.04,17.04 v114.94,17.14 | v154.94,30.48 154.17,29.71 U22.9
  Bottom 0.203: v114.94,17.14 114.94,19.68 115.57,20.32 155.5,20.32 156.21,21.03 156.21,29.92 155.65,30.48 v154.94,30.48
CLK3  (via drill 0.2)
  Top 0.203: v143.31,27.79 144.23,28.71 U22.4 | v142.8,21.34 142.8,16.59 J5.C3
  Bottom 0.203: v143.31,27.79 143.31,21.84 v142.8,21.34
CLK4
  Top 0.203: U22.7 149.62,28.58 150.31,28.58 150.46,28.43 150.46,27.27 148.59,25.4 135.89,25.4 131.64,21.14 131.44,20.95 127.71,17.22 127.71,16.21 127.69,16.19 J6.C3
CLK_SIM  (via drill 0.2)
  Top 0.203: U22.8 148.59,29.21 147.32,30.48 v147.32,31.75 | C12.1 149.17,50.85 D7.CATHODE 148.92,50.49 v148.92,49.35 | v140.03,50.9 139.85,51.08 139.85,51.87 139.81,51.9 U12.38 | v145.36,48.08 142.22,48.08 v142.19,48.06
  Bottom 0.203: v147.32,31.75 147.32,47.75 | 147.32,47.75 v148.92,49.35 | 147.32,47.75 146.99,48.08 v145.36,48.08 | v142.19,48.06 140.03,50.22 v140.03,50.9
D+
  Top 0.203: C8.1 | R2.1 150.24,84.36 C8.1 | J2.3 150.37,85.22 C8.1
D-
  Top 0.203: 150.22,87.27 C7.1 | R1.1 148.12,87.71 148.29,87.88 149.31,87.88 149.92,87.27 150.22,87.27 | J2.2 155.65,86.11 155.14,86.11 153.98,87.27 150.22,87.27
GND  (via drill 0.15, 0.2, 3.17)
  Top 0.152: 92.94,70.05 92.76,69.88 U1.GND
  Top 0.203: v99.67,69.29 99.89,69.51 B1.- | v104.52,57.96 104.55,57.99 105.74,57.99 113.84,49.89 115.18,49.89 115.42,50.12 115.42,52.08 113.93,53.57 113.93,57.52 113.81,57.64 113.77,57.64 U13.6 | v97.38,69.29 95.11,69.29 94.52,69.88 94.26,69.88 U1.3 92.94,70.05 | U12.14 124.67,54.35 U12.81 | U1.10 92.59,70.05 92.76,69.88 | U6.6 36.96,16.35 U6.GND | 39.37,68.17 39.37,68.3 41.61,68.3 U9.F23 | 39.37,68.17 U9.GND | U12.3 125.77,66.2 U12.71 | U2.4 70.4,10.52 70.67,10.52 71.32,11.17 v71.32,12.09 | v69.49,11.68 69.73,11.45 U2.1 | 39.37,68.17 39.34,68.15 37.95,68.15 37.87,68.23 U9.B7 37.87,70.25 37.72,70.4 37.72,70.72 37.94,70.94 38.19,70.94 C34.2 37.35,73.3 v37.31,73.3 | C25.2 34.29,73.13 v34.44,73.28 | U9.AD2 36.62,64.31 36.97,64.66 36.97,65.02 37.76,65.8 37.86,65.8 U9.GND | U9.GND 38.86,66.8 v37.9,66.8 | J7.5 63.3,73.38 v63.68,73.76 | TP28.P$1 5.08,10.03 v5.08,5.08
  Bottom 0.152: 104.52,57.94 v104.52,57.96
  Bottom 0.203: v97.38,69.29 v99.67,69.29 104.52,64.44 104.52,57.94 | v71.32,12.09 69.9,12.09 v69.49,11.68 | v37.31,73.3 37.2,73.3 36.85,73.66 34.82,73.66 v34.44,73.28
  other vias: 5.08,96.52 27.69,72.03 33.02,66.07 32.51,61.16 16.76,8.2 12.88,8.74 14.12,9.37 14.61,4.34 154.94,96.52 154.94,5.08 69.14,9.88 68.73,9.17 70.89,8.18 70.97,7.24 76.58,15.39 77.93,15.72 77.9,10.85 77.95,8.89 78.05,6.93 78.05,5 84.91,4.93 84.86,6.6 84.84,8.36 84.86,10.19 84.99,11.35 86.03,11.43 87.91,11.51 89.76,11.46 77.95,17.73 77.93,19.74 77.9,21.77 84.86,21.89 84.86,20.19 84.86,18.67 84.89,16.66 86,15.39 88.04,15.39 51.33,16.1 45.97,12.9 48.82,8.48 53.67,10.77 57.91,14.71 57.99,11.23 57.94,6.88 63.73,14.88 63.73,11.38 63.73,6.86 25.63,9.98 28.45,10.08 35.99,6.99 40.69,9.14 36.07,10.08 34.01,12.45 39.52,20.55 40.92,15.14 11.76,5.44 7.98,9.42 7.85,12.8 11.94,16.48 11.4,23.6 14.25,18.64 18.47,21.67 16.23,26.85 22.86,27.89 26.75,17.12 2.67,44.42 13.39,44.63 18.69,35.2 18.67,44.04 21.03,30.18 24.99,40.03 24.99,42.47 29.79,65.56 29.82,70.03 35.18,70.38 43.26,68.5 40.13,71.93 40.13,74.7 42.29,74.02 44.58,73.2 44.48,74.88 45.03,77.22 44.98,70.84 48.97,73.48 49.15,66.01 51.56,68.02 52.5,69.44 44.32,58.12 44.81,61.19 62.13,75.39 63.98,78.26 65.66,75.34 64.67,70.84 88.57,64.54 88.6,67.79 95,65.48 95.25,70.56 90.63,71.07 90.96,66.37 99.29,71.55 101.5,68.78 138.15,84.63 143.48,79.55 146.08,86.66 145.01,90.91 148.29,82.12 150.9,86.26 155.8,89.79 152.2,76.38 154.2,77.11 155.37,79.55 157.23,79.86 158.78,79.1 158.9,75.54 155.17,75.64 152.63,68.68 156.26,67.72 142.57,64.21 142.6,63.17 144.25,60.83 144.73,63.63 146.13,65.66 152.63,62.59 150.88,63.09 151.59,65.13 151.56,61.01 151.59,57.94 153.11,55.68 140.67,55.88 144.6,56.24 141.6,54.79 144.53,53.82 141.2,51.82 141.71,50.06 146.23,50.14 149.56,49.96 149.99,54.36 108.05,57.35 110.31,57.43 110.95,55.37 128.24,50.5 133.35,50.57 125.78,58.78 136.37,58.78 134.9,64.14 127.97,63.93 122.45,60.88 119.63,48.36 120.12,52.12 115.04,58.83 33.93,20.85 34.09,24.41 39.14,23.67 37.77,21.06 45.67,18.72 43.54,16.13 48.01,13.23 53.8,16.13 57.07,29.84 57.81,27.46 61.59,33.4 65.05,31.95 62.81,28.24 64.54,23.67 67.89,27.3 103.15,14.22 100.28,16.69 94.36,22.45 88.93,26.49 100.61,30.45 95.07,29.92 118.01,29.79 110.67,29.97 112.73,25.02 110.72,17.86 117.88,15.75 124.51,16.66 123.55,21.77 132.64,23.7 130.23,30.86 125.22,29.41 114.1,32.66 138.79,22.15 148.64,23.47 151.18,31.83 145.08,34.67 138.3,34.37 130.71,34.42 151.36,16.23 145.03,18.21 125.43,13.46 138,17.5 153.59,22.81 91.82,35.46 93.17,40.94 104.57,43 113.69,39.34 121.44,42.09 143.28,84.23 144.63,83.79 15.04,7.04 40.87,68.91 46,73.36 43.33,75.18 39.52,68.94 37.87,68.86 39.42,67.01 41.07,67.08 41.27,66.14 39.95,66.09 118.41,65.79 119.48,69.98 150.34,71.86 152.07,74.45 71.78,12.65 71.75,15.01 70.46,14.96 68.81,14.99 71.55,16.15 71.93,11.25 71.48,10.46 68.58,11.48 69.47,13.06 67.82,14.96 68.22,10.29 41.02,77.98 93.19,61.62
  pour Top (isolate 0.152): -5.08,106.68 166.37,106.68 166.37,-2.54 -7.62,-2.54 -7.62,104.14
  pour Top (isolate 0.152): -5.08,106.68 166.37,106.68 166.37,-2.54 -7.62,-2.54 -7.62,104.14
  pour Bottom (isolate 0.152): -6.96,104.88 164.49,104.88 164.49,-4.34 -9.5,-4.34 -9.5,102.34
GPS_PWR_EN  (via drill 0.15, 0.2, 0.2 pad 0.1)
  Top 0.203: v40.64,59.61 40.64,62.64 40.95,62.94 v40.93,62.95 | v45.41,21.67 44.66,20.92 R26.2 44.61,18.61 U11.3 45.84,17.5 TP10.P$1 | U9.AC15 v39.88,64.57
  Bottom 0.203: v40.64,59.61 40.64,59.69 44.35,59.69 44.86,59.18 44.86,39.42 51,33.27 51,23.9 48.77,21.67 v45.41,21.67 | v39.88,64.57 39.88,64.01 v40.93,62.95
GPS_RF_IN
  Top 0.203: U7.11 65.57,7.56 U4.4
GPS_RXD  (via drill 0.15 pad 0.1, 0.2)
  Top 0.203: U9.M2 v36.63,67.31 | v26.54,65.48 26.54,66.88 v27.89,68.22 | L6.2 48.01,20.25 48.01,23.85 | 48.01,23.85 v48.01,25.32 | TP1.P$1 47.95,23.9 48.01,23.85
  Bottom 0.203: v48.01,25.32 48.01,31.24 38.58,40.66 38.58,51.79 26.54,63.83 v26.54,65.48 | v36.63,67.31 36.5,67.44 36.47,67.44 35.68,68.22 v27.89,68.22
GPS_TXD  (via drill 0.2)
  Top 0.203: v31.73,66.02 32.77,67.06 U9.N1 | v49.96,25.63 49.96,21.83 52.55,19.25 52.64,19.15 | 52.64,19.15 L5.2 | TP2.P$1 52.64,19.15
  Bottom 0.203: v31.73,66.02 29.54,63.83 29.54,62 39.73,51.82 39.73,41.81 49.96,31.57 v49.96,25.63
GPS_VCC
  Top 0.203: U11.2 U11.1 47.04,14.37 R10.2 47.1,9.78 C42.2 | C22.2 47.16,6.48 C42.2 | C42.2 50.84,9.73 C17.2 55.93,9.62 U7.6 U7.7 U7.8
GSM_CTS  (via drill 0.15, 0.2)
  Top 0.203: U13.10 112.43,78.91 111.63,79.7 42.7,79.7 | 42.7,79.7 v40.51,79.7 | U9.A12 | TP16.P$1 42.8,79.81 42.7,79.7
  Bottom 0.203: U9.A12 39.12,78.31 v40.51,79.7
  other vias: 39.12,70.56
GSM_GATED
  Top 0.203: U12.51 U12.52 U12.53 141.66,68.4 | 141.66,68.4 142.74,68.4 Q4.3 | C20.1 153.4,69.6 153.4,67.64 R12.2 152.39,66.62 149.91,66.62 149.59,66.94 C13.1 149.59,70.19 C47.1 148.94,73.54 C30.1 147.62,74.37 141.66,68.4
GSM_LED  (via drill 0.2)
  Top 0.203: Q3.1 150.52,60.19 150.52,57.06 R31.2 150.66,56.92 v148.74,56.92 | U12.16 128.36,51.9 v130.63,54.18
  Bottom 0.203: v130.63,54.18 133.38,56.92 v148.74,56.92
GSM_POWER  (via drill 0.15, 0.2)
  Top 0.203: v39.37,70.05 U9.B13 | v46.46,81.53 55.45,81.53 | 55.45,81.53 63.63,81.53 65,82.91 112.17,82.91 v112.83,82.25 | v115.47,81.48 115.47,54.82 Q1.1 | TP17.P$1 55.45,82.73 55.45,81.53
  Bottom 0.203: v39.37,70.05 39.37,70.28 39.73,70.63 39.73,74.87 39.96,75.11 40.03,75.11 v46.46,81.53 | v112.83,82.25 114.71,82.25 v115.47,81.48
GSM_POWER_GATE
  Top 0.203: R30.2 R6.2
GSM_RST  (via drill 0.15, 0.2)
  Top 0.203: 48.01,86.26 113.28,86.26 114.4,85.14 114.4,53.62 Q2.1 | 48.01,86.26 v39.01,86.26 | v38.63,70.56 U9.A10 | TP19.P$1 48.01,86.26
  Bottom 0.203: v38.63,70.56 38.63,85.88 v39.01,86.26
GSM_RTS  (via drill 0.15, 0.2)
  Top 0.203: U13.9 112.83,79.63 112.14,80.31 105.51,80.31 | U9.B11 v38.86,70.05 | v41.88,72.01 v41.88,73.38 | 105.51,80.31 v50.6,80.31 | TP18.P$1 105.51,80.9 105.51,80.31
  Bottom 0.203: v38.86,70.05 38.99,69.93 38.99,69.89 39.21,69.67 39.85,69.67 41.88,71.7 v41.88,72.01 | v41.88,73.38 42.11,73.61 42.46,73.61 49.16,80.31 v50.6,80.31
GSM_RX  (via drill 0.15, 0.2)
  Top 0.203: U13.8 113.23,79.92 111.45,81.69 65.51,81.69 64.72,80.9 v52.02,80.9 | U9.B9 v38.38,70.05 | v42.75,71.25 43.05,71.55 v44.15,71.55
  Bottom 0.203: v38.38,70.05 38.48,69.95 38.48,69.89 39.01,69.37 39.98,69.37 41.86,71.25 v42.75,71.25 | v44.15,71.55 46.95,71.55 47.02,71.48 49.63,71.48 52.02,73.86 v52.02,80.9
GSM_TX  (via drill 0.15, 0.2)
  Top 0.203: U13.7 113.63,84.06 112.17,85.52 v38.12,85.52 37.54,86.11 TP20.P$1 | v38.1,70.56 U9.A8
  Bottom 0.203: v38.1,70.56 37.85,70.81 37.85,85.24 v38.12,85.52
IO1  (via drill 0.2)
  Top 0.203: J3.C7 96.34,19.23 v95.89,19.68 | v128.27,24.13 128.27,25.39 129.6,26.72 129.6,28.16 129.46,28.31 128.77,28.31 U21.2
  Bottom 0.203: v95.89,19.68 100.03,23.82 127.97,23.82 v128.27,24.13
IO2  (via drill 0.2)
  Top 0.203: J4.C7 113.03,13.77 v113.03,17.78 | v137.16,26.67 136.91,26.92 135.18,26.92 134.62,27.48 134.62,27.94 134.12,28.44 U21.9
  Bottom 0.203: v137.16,26.67 137.36,26.47 137.36,21.79 136.25,20.68 114.2,20.68 113.03,19.51 v113.03,17.78
IO3  (via drill 0.2)
  Top 0.203: v127,16.51 126.77,16.74 126.77,24.36 125.73,25.4 125.73,26.67 126.5,27.44 U21.4 | J5.C7 137.97,15.24 v137.82,15.39
  Bottom 0.203: v127,16.51 136.7,16.51 v137.82,15.39
IO4
  Top 0.203: U21.7 132.85,27.31 132.16,27.31 129.56,24.7 129.54,24.68 127.41,22.55 127.41,16.34 126.42,15.35 J6.C7
IO_SIM  (via drill 0.2)
  Top 0.203: U21.8 132.08,27.94 132.08,28.16 132.02,28.22 132.02,29.16 132.08,29.22 v132.08,30.48 | U12.39 140.21,53 D4.CATHODE 140.59,49.59 C9.1 140.96,40.63 v133.35,33.02
  Bottom 0.203: v132.08,30.48 132.08,31.75 v133.35,33.02
LED_NRF_BLUE  (via drill 0.2)
  Top 0.203: R9.2 49.9,77.22 47.82,79.3 40.34,79.3 40.32,79.32 24.74,79.32 24.16,78.74 v24.16,68.15 | v29.21,67.31 29.96,68.06 U9.J1
  Bottom 0.203: v29.21,67.31 29.21,67.26 29.16,67.31 24.99,67.31 v24.16,68.15
LED_NRF_GREEN  (via drill 0.2)
  Top 0.203: U9.L1 30.83,67.56 v30.38,67.11 | v52.65,84.89 24.18,84.89 v23.32,84.02 | R8.2 55.08,73.5 v53.44,75.13
  Bottom 0.203: v30.38,67.11 29.62,66.34 23.98,66.34 22.78,67.54 22.78,83.49 v23.32,84.02 | v52.65,84.89 52.65,75.79 53.31,75.13 v53.44,75.13
LED_NRF_RED  (via drill 0.15 pad 0.1, 0.2)
  Top 0.203: v44.81,66.85 R7.2 | U9.K2 v36.63,67.82
  Bottom 0.203: v44.81,66.85 43.81,66.85 42.85,67.82 v36.63,67.82
LNA_IN
  Top 0.203: L1.1 69.67,13.76 69.96,13.46 70.76,12.67 70.76,11.04 70.64,10.92 70.4,10.92 U2.5
LNA_OUT
  Top 0.203: U2.3 69.77,10.41 U4.1
MUX_EN  (via drill 0.2)
  Top 0.203: 85.09,29.21 81.7,29.21 R22.2 79.16,28.79 v78.74,29.21 | 85.09,29.21 v86.36,29.21 | U15.5 97.48,26.94 97.46,26.92 94.23,26.92 v93.98,26.67 | 85.09,29.21 85.09,36.83 86.36,38.1 R23.2 96.52,38.52 96.52,39.01 96.88,39.37 107.95,39.37 | 107.95,39.37 107.95,34.71 R24.2 108.8,35.56 v111.76,35.56 | 107.95,39.37 107.95,40.08 108.51,40.64 R21.2 | U20.5 112.03,26.94 v111.76,26.67 | U22.5 143.96,27.03 140.61,27.03 v139.7,27.94 | v127,25.4 128.54,26.94 U21.5 | v66.98,39.75 65.88,40.86 | 65.88,40.86 v64.95,41.78 | v46.1,58.75 v43.31,58.75 | v38.15,60.78 38.15,63.09 38.92,63.86 38.92,63.87 U9.AD12 | TP9.P$1 65.32,40.86 65.88,40.86
  Bottom 0.203: v93.98,26.67 93.98,28.85 93.62,29.21 v86.36,29.21 | v139.7,27.94 139.7,33.02 139.22,33.5 127.51,33.5 127,33.02 127,26.67 | 127,26.67 v127,25.4 | 127,26.67 125.35,26.67 124.72,27.3 116.2,27.3 115.57,26.67 v111.76,26.67 107.11,26.67 107.11,26.72 106.68,27.15 106.68,32.51 107.19,33.02 110.49,33.02 111.76,34.29 v111.76,35.56 | v78.74,29.21 77.52,29.21 v66.98,39.75 | v64.95,41.78 47.98,58.75 v46.1,58.75 | v43.31,58.75 43.28,58.73 40.21,58.73 v38.15,60.78
MUX_SEL1  (via drill 0.2)
  Top 0.203: U20.1 113.03,28.94 | 113.03,28.94 105.68,28.94 104.14,30.48 104.14,34.54 103.12,35.56 98.48,35.56 97.79,34.87 97.79,33.02 | U15.1 97.79,29.31 97.79,33.02 | U21.1 128.27,28.94 128.27,30.48 | U22.1 145.15,31.38 144.78,31.75 128.27,31.75 128.27,30.48 | 97.79,33.02 v96.52,33.02 | 128.27,30.48 113.64,30.48 113.03,29.87 113.03,28.94 | U9.R1 36.01,66.45 35.96,66.45 35.66,66.15 35.66,63.6 | v35.66,62.15 35.66,63.6 | TP23.P$1 35.41,63.86 35.66,63.6
  Bottom 0.203: v96.52,33.02 93.6,33.02 90.55,31.75 76.2,31.75 63.31,44.8 46.23,62.1 46.18,62.15 v35.66,62.15
MUX_SEL2  (via drill 0.15, 0.2)
  Top 0.203: U22.10 149.86,30.58 149.86,32.49 149.33,33.02 v135.89,33.02 134.98,32.11 v123.37,32.11 | v134.62,30.48 133.08,28.94 U21.10 | U15.10 102.5,30.85 v101.6,31.75 | v93.98,34.29 89.79,34.29 | 89.79,34.29 87.63,34.29 v86.36,35.56 | U20.10 123.35,28.94 v123.37,28.96 | v109.22,36.83 115.57,36.83 v116.84,35.56 | v41.38,64.57 U9.AC21 | U9.AC21 | TP26.P$1 89.92,34.42 89.79,34.29
  Bottom 0.203: v135.89,33.02 135.89,31.75 v134.62,30.48 | v101.6,31.75 101.6,34.29 | 101.6,34.29 101.6,35.56 102.51,36.47 105.56,36.47 105.91,36.83 v109.22,36.83 | v116.84,35.56 116.84,33.02 117.75,32.11 v123.37,32.11 v123.37,28.96 | 101.6,34.29 v93.98,34.29 | v86.36,35.56 74.35,35.56 45.34,64.57 v41.38,64.57
N$1
  Top 0.203: R10.1 48.8,12 48.87,11.94 50.33,11.94 D5.A
N$2
  Top 0.203: D5.C 56.04,11.96 U7.4
N$3
  Top 0.203: R1.2 U3.1
N$4
  Top 0.203: U3.12 145.81,83.21 R2.2
N$5
  Top 0.203: B1.+ 99.42,68.01 R17.1 96.62,70.97 96.39,71.2 U1.5
N$6
  Top 0.203: R4.1 145.26,81.02 144.24,82.04 144.24,82.3 U3.10
N$7
  Top 0.203: L5.1 53.46,16.54 53.97,16.54 54.95,15.55 54.95,14.81 55.62,14.15 U7.2
N$8
  Top 0.203: L6.1 53.41,13.05 U7.3
N$9  (via drill 0.2)
  Top 0.203: U13.4 113.23,53.41 113.59,53.05 113.59,51.64 v114.1,51.13 | v121.16,55.83 123.94,55.83 U12.12
  Bottom 0.203: v114.1,51.13 118.8,55.83 v121.16,55.83
N$12  (via drill 0.2)
  Top 0.203: U13.5 113.63,53.44 114.5,52.57 114.5,50.8 v115.01,50.29 | v121.89,54.69 123.56,54.69 123.58,54.71 123.92,54.71 U12.13
  Bottom 0.203: v115.01,50.29 119.41,54.69 v121.89,54.69
N$13
  Top 0.203: C6.1 92.47,68.36 U1.14
N$14
  Top 0.203: LED1.C 151.49,64.07 Q3.3
N$15
  Top 0.203: Q2.3 122,49.7 U12.18
N$16
  Top 0.203: U12.2 121.58,67.3 121.44,67.44 C46.1 121.62,65.19 R29.2
N$17
  Top 0.203: R13.2 U6.8
N$18
  Top 0.203: U12.15 124.23,53.2 Q1.3 119.75,53.59 R29.1
N$19
  Top 0.203: U6.5 35.61,16.71 35.3,16.71 33.21,14.62 D1.C
N$20
  Top 0.203: U1.15 92.94,67.03 93.21,66.75 93.21,64.65 X1.2
N$21
  Top 0.203: X1.1 96.39,65.44 U1.16
N$22
  Top 0.203: L3.1 15.11,3.2 IC1.4
N$23
  Top 0.203: LED1.A 155.23,66.32 R12.1
N$24
  Top 0.203: R3.1 141.67,83.52 U3.7
N$25  (via drill 0.2)
  Top 0.203: U13.3 112.83,53.38 112.93,53.28 112.93,52.45 v113.18,52.2 | v120.73,57.15 124.17,57.15 U12.11
  Bottom 0.203: v113.18,52.2 113.59,52.2 118.64,57.25 120.62,57.25 v120.73,57.15
N$26
  Top 0.203: IC1.2 14.11,3.29 L3.2
N$27
  Top 0.203: U9.C1 34.29,69.56 C25.1
N$28
  Top 0.203: U3.4 143.66,86.65 C18.1 143.96,90.14 FB1.P$1
N$29
  Top 0.203: R5.1 17.03,14.91 C28.1 15.61,10.59 | 15.61,10.59 IC1.6 IC1.7 | IC1.8 14.61,9.59 15.61,10.59
N$31  (via drill 0.2)
  Top 0.203: R33.1 R35.2 v60.02,30.15 | R34.2 v59.89,25.17 | v63.78,25.48 U8.1
  Bottom 0.203: v59.89,25.17 60.2,25.48 61.92,25.48 | 61.92,25.48 v63.78,25.48 | v60.02,30.15 61.92,28.25 61.92,25.48
N$32  (via drill 0.15, 0.2)
  Top 0.203: U9.B5 37.37,71.7 C34.1 36.68,72.58 36.68,73.25 38.31,74.89 38.31,75.12 39.97,76.78 40.39,76.78 | U9.E24 | v40.18,72.62 39.51,72.62 C21.1 39.94,74.24 40.44,74.24 40.54,74.34 40.54,74.88 40.39,75.03 40.39,76.78 | L2.1 40.39,76.98 40.39,76.78
  Bottom 0.203: v40.18,72.62 43.16,72.62 43.64,72.14 43.64,69.57 43.13,69.06 U9.E24
  other vias: 42.62,69.06
N$33
  Top 0.203: IC1.10 13.61,8.36 R32.2 12.83,11.75 R36.1
N$34
  Top 0.203: U9.D23 42.47,69.66 43.18,69.66 43.93,70.41 45.15,70.41 45.15,69.98 47.18,69.98 C14.1
N$35
  Top 0.203: C19.1 12.72,23.61 12.72,20.54 U5.4
N$36
  Top 0.203: C31.1 65.59,26.66 U8.3
N$39
  Top 0.203: U8.2 64.79,26.51 64.79,24.93 63.12,23.26 C35.1
N$43
  Top 0.203: C1.2 46.5,74.84 X4.3 45.6,74.73 46.5,73.82 46.5,72.46 46.28,72.23 46.28,72.11 U9.B24
N$45  (via drill 0.2)
  Top 0.203: U9.A23 42.12,71.67 42.29,71.84 42.29,72.03 X4.1 43.7,73.14 v44.63,72.21 | C2.2 47.38,72.07 v47.19,71.88
  Bottom 0.203: v47.19,71.88 44.96,71.88 v44.63,72.21
N$46
  Top 0.203: U9.B3 36.58,70.06 36.58,71.02 36.07,71.53 36.06,71.53 36.06,74.8 L4.2
N$47
  Top 0.203: L4.1 38.61,77.12 L2.2
N$48
  Top 0.203: U9.N24 42.72,67.16 42.79,67.16 44.21,68.58 C15.1
N$49  (via drill 0.2)
  other vias: 145.8,68.48
N$53  (via drill 0.2)
  Top 0.203: U13.2 112.52,57.04 v112.52,53.11 | v120.47,58.55 124.38,58.55 U12.10
  Bottom 0.203: v112.52,53.11 117.96,58.55 v120.47,58.55
N$55
  Top 0.203: R18.2 21.73,31.22 | 21.73,31.22 21.73,28.26 U10.1 U10.2 | 24.19,39.02 R28.2 24.19,33.68 21.73,31.22 | 24.19,39.02 C41.1 24.16,41.5 23.55,42.1 23.55,45.09 R19.2 22.99,45.66 R20.2 | J1.4 23.84,39.37 24.19,39.02
N$56  (via drill 0.2)
  other vias: 122.25,56.36
N$59
  Top 0.203: D2.2 52.53,66.47 52.1,66.04 50.66,66.04 R7.1
N$60
  Top 0.203: D2.4 53.38,68.92 R8.1
N$61
  Top 0.203: R9.1 51.6,68.63 51.16,68.19 51.16,67.11 D2.3
N$66
  Top 0.203: R6.1 144.97,65.33 Q4.1
N$68
  Top 0.203: R25.1 110.37,56.38 111.64,57.64 111.89,57.64 U13.12
N$69
  Top 0.203: U12.56 135.17,69.85 135.17,70.19 142.4,77.42 C5.1
N$70
  Top 0.356: C5.2 153.4,77.97 arc-45 155.19,78.72 J8.SIG
N$71
  Top 0.203: 146.52,54.67 D6.ANODE 146.23,52.93 148.35,50.81 | 146.52,54.67 147.03,55.18 C12.2 | 148.35,50.81 D7.ANODE | 145.19,54.67 144.28,54.67 D3.ANODE 142.24,52.63 D4.ANODE | 145.19,54.67 146.52,54.67 | C11.2 144.03,55.83 145.19,54.67 | C9.2 143.84,50.71 C10.2 145.34,50.81 148.35,50.81
N$88  (via drill 0.2)
  other vias: 89.76,15.42
NRF_GPIO_0  (via drill 0.15 pad 0.1, 0.2)
  Top 0.203: TP29.P$1 26.67,68.89 v27.99,68.89 | U9.H2 v36.61,68.31 v36.6,68.3
  Bottom 0.203: v27.99,68.89 36.35,68.89 36.6,68.63 v36.6,68.3
NRF_GPIO_1
  Top 0.203: U9.G1 29.21,68.56 TP30.P$1
NRF_MISO  (via drill 0.2)
  Top 0.203: J1.7 v19.41,42.65 | R20.1 v20.78,49.94 20.78,50.88 TP7.P$1 | v25.58,50.67 25.58,50.94 38.62,63.99 U9.AD10 | U1.6 92.94,72.11 92.15,72.9 84.78,72.9 57.73,45.85 28.85,45.85 v26.47,48.23
  Bottom 0.203: v19.41,42.65 19.41,48.56 v20.78,49.94 21.84,51 24.5,51 24.83,50.67 v25.58,50.67 25.58,49.12 v26.47,48.23
NRF_MOSI  (via drill 0.2)
  Top 0.203: U9.AD8 38.02,63.96 38.02,63.89 24.74,50.61 v24.33,50.61 v24.33,50.6 | U1.9 85.26,70.55 v84.53,69.85 | J1.3 21.19,38.27 v21.49,37.97 20.03,36.51 R18.1 19.57,30.91 TP5.P$1 | v82.73,67.18 59.44,43.89 v31.32,43.89
  Bottom 0.203: v24.33,50.6 24.33,49.61 25.2,48.74 | 25.2,48.74 25.2,44.6 21.49,40.89 v21.49,37.97 | v82.73,67.18 82.73,68.05 v84.53,69.85 | v31.32,43.89 30.05,43.89 25.2,48.74
NRF_SCK  (via drill 0.2)
  Top 0.152: 25.35,43.69 v25.35,43.54
  Top 0.203: U1.7 92.44,71.3 92.26,71.47 92.26,71.63 92.14,71.75 85.14,71.75 58.31,44.92 38.53,44.92 38.01,44.4 28.83,44.4 v27.53,43.1 | v21.11,41.81 19.77,40.47 J1.5 | v24.26,44.78 25.35,43.69
  Bottom 0.152: 24.08,44.78 v24.26,44.78
  Bottom 0.203: v21.11,41.81 24.08,44.78 | v25.35,43.54 27.1,43.54 v27.53,43.1
NRF_SWDCLK  (via drill 0.2)
  Top 0.203: U9.AA24 42.67,65.11 52.44,65.11 v52.55,65.23 | J7.4 64.57,74.4 65.16,74.99 65.16,76.07 64.88,76.35 64.88,77.67 65.81,78.61 67.13,78.61 68.07,77.67 68.07,76.46 | v69.44,75.08 68.07,76.46 | TP15.P$1 69.65,76.46 68.07,76.46
  Bottom 0.203: v52.55,65.23 56.77,69.44 65.17,69.44 68.86,73.13 68.86,74.5 v69.44,75.08
NRF_SWDIO  (via drill 0.2)
  Top 0.203: v64.08,75.13 64.57,75.46 J7.2 | U9.AC24 42.73,64.67 v48.95,64.67 51.23,64.67 TP14.P$1
  Bottom 0.203: v64.08,75.13 64.06,75.11 64.06,73.6 64.01,73.55 64.01,71.73 62.02,69.75 54.03,69.75 v48.95,64.67
RST1  (via drill 0.2)
  Top 0.203: J3.C2 99.06,13.21 v99.06,20.32 | v109.22,21.59 109.58,21.95 109.58,28.09 109.92,28.44 U20.2
  Bottom 0.203: v99.06,20.32 99.95,21.21 108.84,21.21 v109.22,21.59
RST2  (via drill 0.2)
  Top 0.203: J4.C2 116.84,13.56 116.84,20.32 109.22,20.32 107.95,21.59 v107.95,27.94 | U20.9 117.87,28.31 119.52,28.31 119.88,27.94 v121.92,27.94
  Bottom 0.203: v107.95,27.94 107.95,30.66 109.04,31.75 110.87,31.75 111.5,31.12 121.92,31.12 v121.92,27.94
RST3  (via drill 0.2)
  Top 0.203: v107.95,8.89 107.95,15.24 v109.22,16.51 | U20.4 111.64,27.44 111.13,26.93 111.13,25.14 111.76,24.51 v111.76,21.59 | v140.49,10.24 140.49,13 J5.C2
  Bottom 0.203: v109.22,16.51 109.22,19.05 v111.76,21.59 | v107.95,8.89 139.14,8.89 v140.49,10.24
RST4  (via drill 0.2)
  Top 0.203: v125.35,17.75 125.15,17.96 125.15,24.26 v124.97,24.43 | U20.7 119.14,27.44 119.91,26.67 v121.92,26.67 | v128.91,17.22 128.91,13.03 J6.C2
  Bottom 0.203: v121.92,26.67 122.73,26.67 v124.97,24.43 | v125.35,17.75 128.37,17.75 v128.91,17.22
RST_SIM  (via drill 0.2)
  Top 0.203: U20.8 119.45,27.94 120.31,27.08 122.09,27.08 122.33,26.84 122.33,26.5 122.15,26.32 v122.15,25.96 | D6.CATHODE v143.91,51.56 v143.92,51.56 | v143.92,49.38 145.17,49.38 C10.1 | U12.40 139.95,54.1 v140.26,53.8 | v114.3,21.59 114.3,23.14 v116.03,24.87 | v140.97,24.13 140.97,19.81 v140.44,19.28
  Bottom 0.203: v140.97,24.13 140.97,27.94 143.92,30.89 v143.92,49.38 v143.92,51.56 142.49,51.56 v140.26,53.8 | v116.03,24.87 121.61,24.87 122.15,25.4 v122.15,25.96 | v140.44,19.28 135.28,19.28 134.88,19.68 122.96,19.68 122.71,19.43 122.71,18.94 120.28,16.51 113.4,16.51 112.4,17.52 112.4,21.01 112.98,21.59 v114.3,21.59
SD_EN  (via drill 0.15 pad 0.1, 0.2)
  Top 0.203: U10.3 21.34,26.75 21.24,26.75 20.11,27.88 19.89,27.88 | 19.89,27.88 R27.1 15.15,27.88 TP6.P$1 | v38.38,64.57 U9.AC9 | 19.89,27.88 19.89,28.83 v20.4,29.34 | v34.67,58.34 34.67,57.73 33.07,56.13 v33.02,56.13
  Bottom 0.203: v38.38,64.57 36.37,62.56 35.49,62.56 33.71,60.77 33.71,59.31 v34.67,58.34 | v20.4,29.34 29.49,29.34 33.27,33.12 33.27,55.88 v33.02,56.13
UART_RX  (via drill 0.2)
  Top 0.203: v41.91,74.93 41.91,74.4 41.05,73.54 41.05,71.49 U9.A16 | v50.24,84.4 50.32,84.48 52.82,84.48 52.98,84.63 v111.38,84.63 | R3.2 138.32,84.23 137.98,84.23 137.45,84.76 124.59,84.76 | v116.15,84.76 124.59,84.76 | TP24.P$1 124.59,86.51 124.59,84.76
  Bottom 0.203: v111.38,84.63 116.03,84.63 v116.15,84.76 | v41.91,74.93 50.24,83.26 v50.24,84.4
UART_TX  (via drill 0.2)
  Top 0.203: R4.2 141.55,78.55 141.33,78.77 140.36,78.77 139.95,78.36 124.26,78.36 v118.8,83.82 | v112.14,83.82 59.84,83.82 | 59.84,83.82 v48.56,83.82 | U9.A14 40.74,71.69 40.74,73.67 40.82,73.74 40.82,73.91 41.38,74.47 41.43,74.47 41.5,74.55 41.5,75.1 41.91,75.5 v41.91,76.2 | TP25.P$1 59.72,83.69 59.84,83.82
  Bottom 0.203: v112.14,83.82 v118.8,83.82 | v41.91,76.2 48.56,82.86 v48.56,83.82
V_GSM_INT  (via drill 0.2)
  Top 0.203: U13.1 112.03,54.67 v112.04,54.66 | U12.4 124.06,64.75 122.83,64.75 121.44,63.35 v120.83,63.35
  Bottom 0.203: v120.83,63.35 120.73,63.35 v112.04,54.66
VCC  (via drill 0.2)
  Top 0.152: U9.Y2 36.41,65.1 v36.17,65.1 | U9.AD14 v39.62,63.45 | U9.AD23 42.32,63.86 v42.32,63.48 | v41.96,60.45 41.96,59.63 C27.1 | U9.A22 41.66,70.52 v41.66,70.1 | v10.39,20.47 10.89,20.47 U5.5 | C39.1 15.99,20.99 v15.9,20.9 | D2.1 52.98,67.67 v53.7,67.67 | R15.1 89.39,64.12 v89.64,64.36 | v86.36,66.14 87.14,66.92 R14.1 | C24.1 31.1,64.53 | 31.54,64.98 31.1,64.54 31.1,64.53 | v30.61,64.03 31.1,64.53
  Top 0.203: C33.1 31.51,64.95 31.54,64.98 C40.1 | v24.87,27.56 24.34,27.56 U10.5 U10.6 | v41.53,15.67 41.88,15.32 U11.5 U11.6 | TP31.TP 23.55,64.75 v23.9,64.39 | 106.8,58.08 R25.2 109.64,58.52 v110.34,58.52 110.42,58.44 U13.11 | U9.B1 36.12,70.49 v36.17,70.54 | v89.64,64.36 89.64,66.1 U1.13 | C26.1 43.66,60.36 v43.66,60.73 | v139.72,79.76 140.92,79.76 140.99,79.69 C29.1 143.22,81.92 143.42,81.92 143.66,82.16 U3.9 | v62.26,70.64 62.64,71.02 63.3,71.02 63.89,71.62 63.89,73.44 64.06,73.6 64.06,73.92 63.89,74.08 63.89,74.72 63.3,75.32 J7.1 | U9.W1 36.17,65.51 v36.17,65.1 | TP27.P$1 9.5,21.36 v10.39,20.47 | R15.1 89.39,62.81 C32.1
  pour Route15: -10.97,109.88 164.49,109.88 170.36,104.01 170.36,-0.79 164.08,-7.06 -8.99,-7.06 -12.52,-3.53 -12.52,108.33
VCC1
  Top 0.203: J3.C1 101.6,13.21 101.6,22.99 100.46,24.13 88.09,24.13 87.63,24.59 87.63,31.75 88.9,33.02 95.25,33.02 | 95.25,33.02 96.52,31.75 96.52,29.21 97.29,28.44 U15.2 | R24.1 105.83,36.41 105.41,36.83 96.29,36.83 95.25,35.79 95.25,33.02
VCC2  (via drill 0.2)
  Top 0.203: v105.41,25.4 105.41,27.94 104.91,28.44 U15.9 | v105.41,40.64 105.05,41 96.37,41 94.39,39.01 84.73,39.01 77.47,31.75 77.47,25.4 81.66,25.4 83.28,23.77 92.35,23.77 92.73,23.39 92.73,20.14 92.71,20.12 92.71,9.98 94.34,8.36 118.85,8.36 J4.C1 118.85,24.15 116.58,26.41 112.77,26.41 v111.76,25.4 | v104.14,38.1 R23.1
  Bottom 0.203: v111.76,25.4 v105.41,25.4 | v105.41,40.64 105.41,39.37 v104.14,38.1
VCC3  (via drill 0.2)
  Top 0.203: U15.4 95.99,27.43 95.48,27.94 v92.71,27.94 | R22.1 83.82,26.67 v85.09,25.4 | v91.72,22 v91.72,23.32 | v141.94,8.61 143.05,9.73 J5.C1
  Bottom 0.203: v85.09,25.4 87.63,27.94 92.66,27.94 | 92.66,27.94 v92.71,27.94 | v91.72,22 91.72,8.84 93.14,7.42 140.74,7.42 v141.94,8.61 | v91.72,23.32 91.72,27 92.66,27.94
VCC4  (via drill 0.2)
  Top 0.203: R21.1 119.38,41.06 119.38,41.91 86.36,41.91 76.2,31.75 76.2,24.13 77.47,22.86 v88.9,22.86 | v104.14,25.4 103.81,25.73 103.81,26.74 103.3,27.26 102.68,27.26 U15.7 | J6.C1 131.5,11.68 v131.39,11.58
  Bottom 0.203: 92.71,22.43 92.71,12.09 93.37,11.43 131.24,11.43 v131.39,11.58 | 92.71,22.43 92.71,24.89 93.22,25.4 v104.14,25.4 | v88.9,22.86 92.28,22.86 92.71,22.43
VCC_RF
  Top 0.203: U7.14 67.46,10.85 | 67.46,10.85 69.09,10.85 | 69.09,10.85 U2.2 | C16.2 67.46,10.85 | U2.6 70.33,12.48 70.26,12.55 69.19,12.55 69.09,12.45 69.09,10.85
VCC_SIM  (via drill 0.2)
  Top 0.203: v121.92,34.29 108.94,34.29 108.33,33.68 108.19,33.54 105.89,31.24 v105.89,30.43 | D3.CATHODE 142.16,55.54 C11.1 141.76,55.83 141.13,55.2 U12.41 135.47,55.2 v134.87,54.61 | U15.8 104.32,27.94 v104.57,27.69
  Bottom 0.203: v121.92,34.29 134.87,47.24 v134.87,54.61 | v104.57,27.69 104.57,29.11 v105.89,30.43
VCCA  (via drill 0.2)
  Top 0.203: IC1.1 13.42,5.28 10.59,8.11 R36.2 8.9,11.74 C38.1 8.9,15.79 U5.1 11.54,17.53 11.54,17.29 11.65,17.17 12.42,17.17 12.54,17.29 12.54,17.53 12.95,17.94 | U5.3 12.95,17.94 | 12.95,17.94 13.09,17.94 C45.1 17.16,18.18 C44.1 22.18,23.65 30.58,23.65 33.76,26.82 41.91,26.82 42.88,27.79 42.88,30.25 49.76,37.13 65.66,37.13 v71.48,42.95 | Q4.2 145.56,68.89 145.96,68.89 146.89,67.96 146.89,60.43 146.13,59.66 v142.85,59.66
  Bottom 0.203: v142.85,59.66 129.59,59.66 113.79,43.87 72.39,43.87 v71.48,42.95
WDI  (via drill 0.15, 0.2)
  Top 0.203: U8.6 v65.66,30.45 | v36.63,66.32 U9.T2 | v50.06,32.69 54.28,32.69 | 54.28,32.69 v56.62,32.69 | TP3.P$1 54.28,34.44 54.28,32.69
  Bottom 0.203: v36.63,66.32 36.63,64.14 33.05,60.55 33.05,58.93 40.03,51.94 40.03,42.72 v50.06,32.69 | v56.62,32.69 63.42,32.69 v65.66,30.45
XL3  (via drill 0.15, 0.2)
  Top 0.203: v32.61,69.77 32.61,70.84 X5.A 31.94,71.84 31.34,71.84 31.34,72.44 C4.2 | v36.63,69.32 U9.D2 | U9.D2
  Bottom 0.203: v32.61,69.77 36.2,69.77 36.63,69.34 v36.63,69.32
XL4
  Top 0.203: U9.F2 36.44,68.81 36.29,68.96 30.96,68.96 30.96,70.84 X5.B 28.83,70.84 C3.2

## Text on the board
tNames: Neha Godbole | Persimmon | 11/19 | Revision A